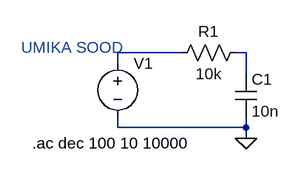
[diagram p0: schematic LowPassFilter.asc]
LowPassFilter.asc, the LTspice schematic file:
Version 4
SHEET 1 880 680
WIRE 128 272 32 272
WIRE 224 272 208 272
WIRE 32 288 32 272
WIRE 224 304 224 272
WIRE 32 384 32 368
WIRE 224 384 224 368
WIRE 224 384 32 384
WIRE 224 400 224 384
FLAG 224 400 0
SYMBOL voltage 32 272 R0
SYMATTR InstName V1
SYMATTR Value ""
SYMATTR Value2 AC 1
SYMBOL res 224 256 R90
WINDOW 0 0 56 VBottom 2
WINDOW 3 32 56 VTop 2
SYMATTR InstName R1
SYMATTR Value 10k
SYMBOL cap 208 304 R0
SYMATTR InstName C1
SYMATTR Value 10n
TEXT -96 408 Left 2 !.ac dec 100 10 10000
TEXT -112 264 Left 2 ;UMIKA SOOD

The netlist it stands for:
* LowPassFilter.asc
V1 N001 0 AC 1
R1 N002 N001 10k
C1 N002 0 10n
.ac dec 100 10 10000
* UMIKA SOOD
.backanno
.end